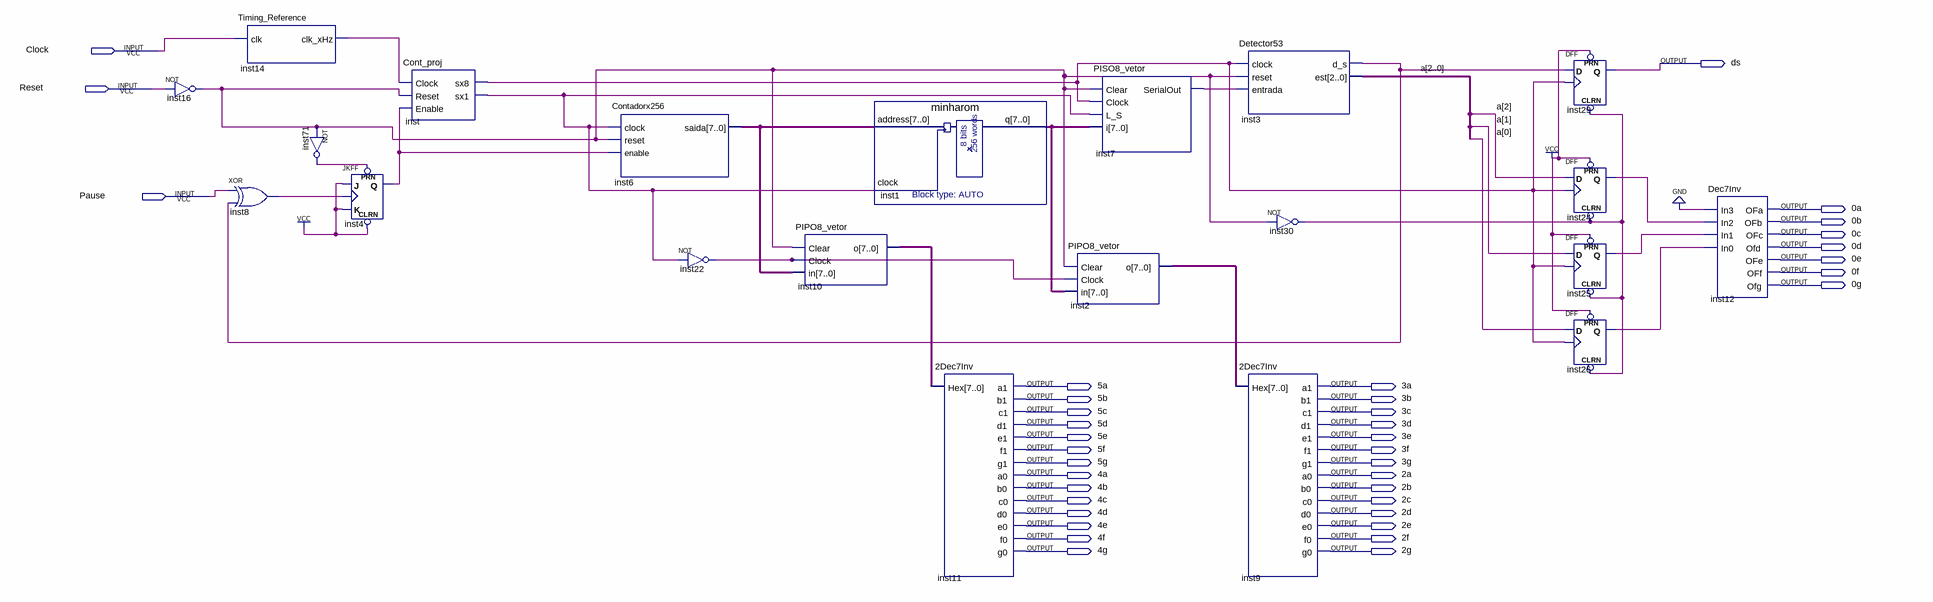
[diagram p0: schematic sheet]
// Quartus schematic Lab7.bdf as structural Verilog: 21 symbols, 39 pins
module Lab7 (
  input  Clock,
  input  Reset,
  input  Pause,
  output ds,
  output \0a ,
  output \0b ,
  output \0c ,
  output \0d ,
  output \0e ,
  output \0f ,
  output \0g ,
  output \5a ,
  output \3a ,
  output \5b ,
  output \3b ,
  output \5c ,
  output \3c ,
  output \5d ,
  output \3d ,
  output \5e ,
  output \3e ,
  output \5f ,
  output \3f ,
  output \5g ,
  output \3g ,
  output \4a ,
  output \2a ,
  output \4b ,
  output \2b ,
  output \4c ,
  output \2c ,
  output \4d ,
  output \2d ,
  output \4e ,
  output \2e ,
  output \4f ,
  output \2f ,
  output \4g ,
  output \2g 
);

  wire inst3_d_s, inst4_q, inst7_serialout, inst8_out, inst14_clk_xhz, inst16_out, inst22_out, inst24_q,
       inst25_q, inst26_q, inst30_out, inst71_out, inst_sx1, inst_sx8;
  wire [2:0] a;
  wire [7:0] inst1_q, inst2_o, inst6_saida, inst10_o;

  not inst16 (inst16_out, Reset);
  Timing_Reference inst14 (.clk(Clock), .clk_xHz(inst14_clk_xhz));
  xor inst8 (inst8_out, Pause, inst3_d_s);
  not inst71 (inst71_out, inst16_out);
  JKFF inst4 (.PRN(inst71_out), .CLRN(1'b1), .K(1'b1), .J(1'b1), .CLK(inst8_out), .Q(inst4_q));
  Cont_proj inst (.Clock(inst14_clk_xhz), .Reset(inst16_out), .Enable(inst4_q), .sx8(inst_sx8), .sx1(inst_sx1));
  Contadorx256 inst6 (.clock(inst_sx1), .reset(inst16_out), .enable(inst4_q), .saida(inst6_saida));
  not inst22 (inst22_out, inst_sx1);
  PIPO8_vetor inst10 (.Clear(inst16_out), .Clock(inst22_out), .in(inst6_saida), .o(inst10_o));
  minharom inst1 (.address(inst6_saida), .clock(inst_sx1), .q(inst1_q));
  \2Dec7Inv  inst11 (
    .Hex(inst10_o), .a1(\5a ), .b1(\5b ), .c1(\5c ), .d1(\5d ), .e1(\5e ), .f1(\5f ), .g1(\5g ), .a0(\4a ),
    .b0(\4b ), .c0(\4c ), .d0(\4d ), .e0(\4e ), .f0(\4f ), .g0(\4g ));
  PIPO8_vetor inst2 (.Clear(inst16_out), .Clock(inst22_out), .in(inst1_q), .o(inst2_o));
  PISO8_vetor inst7 (.Clear(inst16_out), .Clock(inst_sx8), .L_S(inst_sx1), .i(inst1_q), .SerialOut(inst7_serialout));
  Detector53 inst3 (.clock(inst_sx8), .reset(inst16_out), .entrada(inst7_serialout), .d_s(inst3_d_s), .est(a));
  not inst30 (inst30_out, inst16_out);
  \2Dec7Inv  inst9 (
    .Hex(inst2_o), .a1(\3a ), .b1(\3b ), .c1(\3c ), .d1(\3d ), .e1(\3e ), .f1(\3f ), .g1(\3g ), .a0(\2a ),
    .b0(\2b ), .c0(\2c ), .d0(\2d ), .e0(\2e ), .f0(\2f ), .g0(\2g ));
  DFF inst29 (.CLRN(inst30_out), .CLK(inst_sx8), .D(inst3_d_s), .PRN(1'b1), .Q(ds));
  DFF inst24 (.CLRN(inst30_out), .CLK(inst_sx8), .D(a[2]), .PRN(1'b1), .Q(inst24_q));
  DFF inst25 (.CLRN(inst30_out), .CLK(inst_sx8), .D(a[1]), .PRN(1'b1), .Q(inst25_q));
  DFF inst26 (.CLRN(inst30_out), .CLK(inst_sx8), .D(a[0]), .PRN(1'b1), .Q(inst26_q));
  Dec7Inv inst12 (
    .In3(1'b0), .In2(inst24_q), .In1(inst25_q), .In0(inst26_q), .OFa(\0a ), .OFb(\0b ), .OFc(\0c ),
    .Ofd(\0d ), .OFe(\0e ), .OFf(\0f ), .Ofg(\0g ));
endmodule
